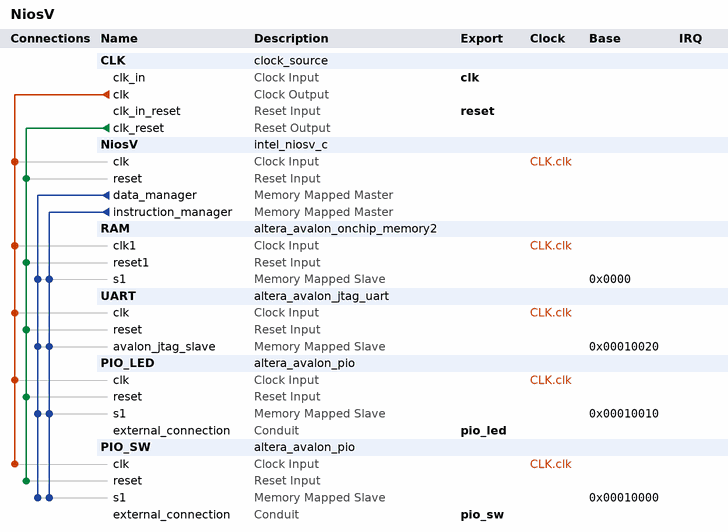
[diagram p0: system contents]
# Platform Designer (Qsys) system NiosV, Cyclone V 5CSXFC6D6F31C6
# Parameters at their usual value, and those the tool derives, are not listed.
package require -exact qsys 24.1
create_system NiosV
set_project_property DEVICE_FAMILY {Cyclone V}
set_project_property DEVICE 5CSXFC6D6F31C6

add_instance CLK clock_source 24.1
set_instance_parameter_value CLK clockFrequency 50000000

add_instance NiosV intel_niosv_c 3.0.0
set_instance_parameter_value NiosV clockFrequency 50000000
set_instance_parameter_value NiosV enableAvalonInterface false
set_instance_parameter_value NiosV enableECCLite false
set_instance_parameter_value NiosV numGpr 32
set_instance_parameter_value NiosV resetOffset 0
set_instance_parameter_value NiosV resetSlave RAM.s1
set_instance_parameter_value NiosV useResetReq false

add_instance RAM altera_avalon_onchip_memory2 24.1
set_instance_parameter_value RAM dataWidth 32
set_instance_parameter_value RAM dualPort false
set_instance_parameter_value RAM initMemContent true
set_instance_parameter_value RAM initializationFileName onchip_mem.hex
set_instance_parameter_value RAM memorySize 40960

add_instance UART altera_avalon_jtag_uart 24.1
set_instance_parameter_value UART simInteractiveOptions NO_INTERACTIVE_WINDOWS

add_instance PIO_LED altera_avalon_pio 24.1
set_instance_parameter_value PIO_LED direction Output
set_instance_parameter_value PIO_LED width 8

add_instance PIO_SW altera_avalon_pio 24.1
set_instance_parameter_value PIO_SW direction Input
set_instance_parameter_value PIO_SW width 8

# connections
add_connection CLK.clk NiosV.clk clock
add_connection CLK.clk PIO_LED.clk clock
add_connection CLK.clk PIO_SW.clk clock
add_connection CLK.clk RAM.clk1 clock
add_connection CLK.clk UART.clk clock
add_connection CLK.clk_reset NiosV.reset reset
add_connection CLK.clk_reset PIO_LED.reset reset
add_connection CLK.clk_reset PIO_SW.reset reset
add_connection CLK.clk_reset RAM.reset1 reset
add_connection CLK.clk_reset UART.reset reset
add_connection NiosV.data_manager PIO_LED.s1 avalon
set_connection_parameter_value NiosV.data_manager/PIO_LED.s1 baseAddress 0x00010010
add_connection NiosV.data_manager PIO_SW.s1 avalon
set_connection_parameter_value NiosV.data_manager/PIO_SW.s1 baseAddress 0x00010000
add_connection NiosV.data_manager RAM.s1 avalon
set_connection_parameter_value NiosV.data_manager/RAM.s1 baseAddress 0x0000
add_connection NiosV.data_manager UART.avalon_jtag_slave avalon
set_connection_parameter_value NiosV.data_manager/UART.avalon_jtag_slave baseAddress 0x00010020
add_connection NiosV.instruction_manager PIO_LED.s1 avalon
set_connection_parameter_value NiosV.instruction_manager/PIO_LED.s1 baseAddress 0x00010010
add_connection NiosV.instruction_manager PIO_SW.s1 avalon
set_connection_parameter_value NiosV.instruction_manager/PIO_SW.s1 baseAddress 0x00010000
add_connection NiosV.instruction_manager RAM.s1 avalon
set_connection_parameter_value NiosV.instruction_manager/RAM.s1 baseAddress 0x0000
add_connection NiosV.instruction_manager UART.avalon_jtag_slave avalon
set_connection_parameter_value NiosV.instruction_manager/UART.avalon_jtag_slave baseAddress 0x00010020

# exported interfaces
add_interface clk clock sink
set_interface_property clk EXPORT_OF CLK.clk_in
add_interface pio_led conduit end
set_interface_property pio_led EXPORT_OF PIO_LED.external_connection
add_interface pio_sw conduit end
set_interface_property pio_sw EXPORT_OF PIO_SW.external_connection
add_interface reset reset sink
set_interface_property reset EXPORT_OF CLK.clk_in_reset

set_interconnect_requirement {$system} qsys_mm.clockCrossingAdapter HANDSHAKE
set_interconnect_requirement {$system} qsys_mm.enableEccProtection FALSE
set_interconnect_requirement {$system} qsys_mm.insertDefaultSlave FALSE
set_interconnect_requirement {$system} qsys_mm.maxAdditionalLatency 1

save_system NiosV.qsys
